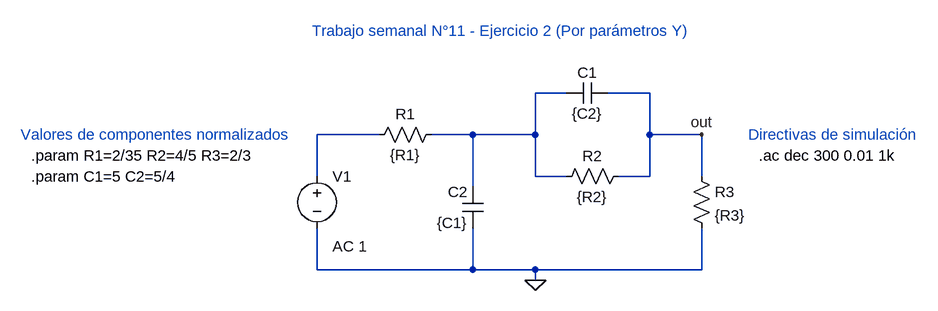
[diagram p0: schematic TS11_ej2_admitancia.asc]
TS11_ej2_admitancia.asc, the LTspice schematic file:
Version 4
SHEET 1 880 680
WIRE 112 32 64 32
WIRE 240 32 176 32
WIRE -176 96 -272 96
WIRE -32 96 -96 96
WIRE 64 96 64 32
WIRE 64 96 -32 96
WIRE 240 96 240 32
WIRE 320 96 240 96
WIRE -272 160 -272 96
WIRE 64 160 64 96
WIRE 112 160 64 160
WIRE 240 160 240 96
WIRE 240 160 192 160
WIRE 320 160 320 96
WIRE -32 176 -32 96
WIRE -272 304 -272 240
WIRE -32 304 -32 240
WIRE -32 304 -272 304
WIRE 64 304 -32 304
WIRE 320 304 320 240
WIRE 320 304 64 304
WIRE 64 320 64 304
FLAG 64 320 0
FLAG 320 96 out
SYMBOL res 304 144 R0
SYMATTR InstName R3
SYMATTR Value {R3}
SYMBOL res 208 144 R90
WINDOW 0 0 56 VBottom 2
WINDOW 3 32 56 VTop 2
SYMATTR InstName R2
SYMATTR Value {R2}
SYMBOL res -192 112 R270
WINDOW 0 32 56 VTop 2
WINDOW 3 0 56 VBottom 2
SYMATTR InstName R1
SYMATTR Value {R1}
SYMBOL cap 176 16 R90
WINDOW 0 0 32 VBottom 2
WINDOW 3 32 32 VTop 2
SYMATTR InstName C1
SYMATTR Value {C2}
SYMBOL cap -16 240 R180
WINDOW 0 24 56 Left 2
WINDOW 3 24 8 Left 2
SYMATTR InstName C2
SYMATTR Value {C1}
SYMBOL voltage -272 144 R0
WINDOW 123 24 124 Left 2
WINDOW 39 0 0 Left 0
SYMATTR Value2 AC 1
SYMATTR InstName V1
SYMATTR Value ""
TEXT 408 128 Left 2 !.ac dec 300 0.01 1k
TEXT -280 -64 Left 2 ;Trabajo semanal N°11 - Ejercicio 2 (Por parámetros Y)
TEXT 392 96 Left 2 ;Directivas de simulación
TEXT -728 96 Left 2 ;Valores de componentes normalizados
TEXT -712 128 Left 2 !.param R1=2/35 R2=4/5 R3=2/3
TEXT -712 160 Left 2 !.param C1=5 C2=5/4

The netlist it stands for:
* TS11_ej2_admitancia.asc
R3 out 0 {R3}
R2 out N001 {R2}
R1 N002 N001 {R1}
C1 out N001 {C2}
C2 0 N001 {C1}
V1 N002 0 AC 1
.ac dec 300 0.01 1k
* Trabajo semanal N°11 - Ejercicio 2 (Por parámetros Y)
* Directivas de simulación
* Valores de componentes normalizados
.param R1=2/35 R2=4/5 R3=2/3
.param C1=5 C2=5/4
.backanno
.end